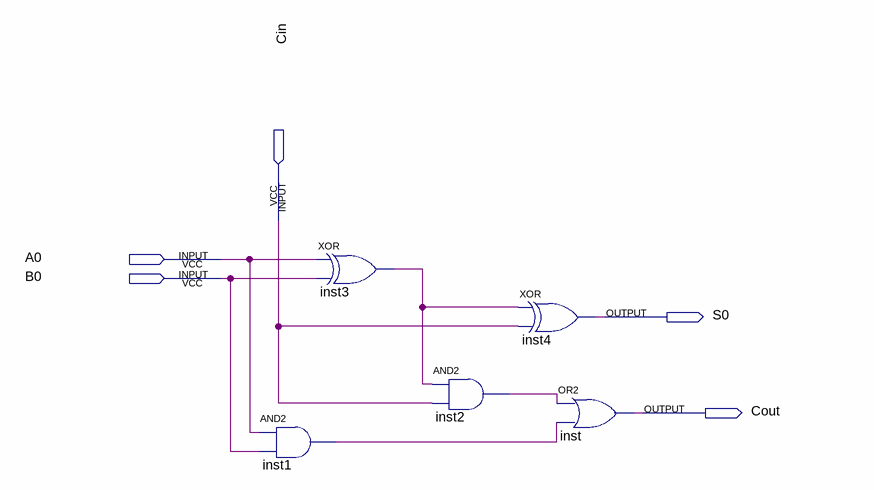
[diagram p0: schematic sheet]
// Quartus schematic SomadorBit.bdf as structural Verilog: 5 symbols, 5 pins
module SomadorBit (
  input  Cin,
  input  A0,
  input  B0,
  output S0,
  output Cout
);

  wire inst1_out, inst2_out, inst3_out;

  and inst1 (inst1_out, A0, B0);
  xor inst3 (inst3_out, A0, B0);
  and inst2 (inst2_out, inst3_out, Cin);
  xor inst4 (S0, inst3_out, Cin);
  or inst (Cout, inst2_out, inst1_out);
endmodule
